# EAGLE design botboardpro-rev5 (EAGLE 4.14)
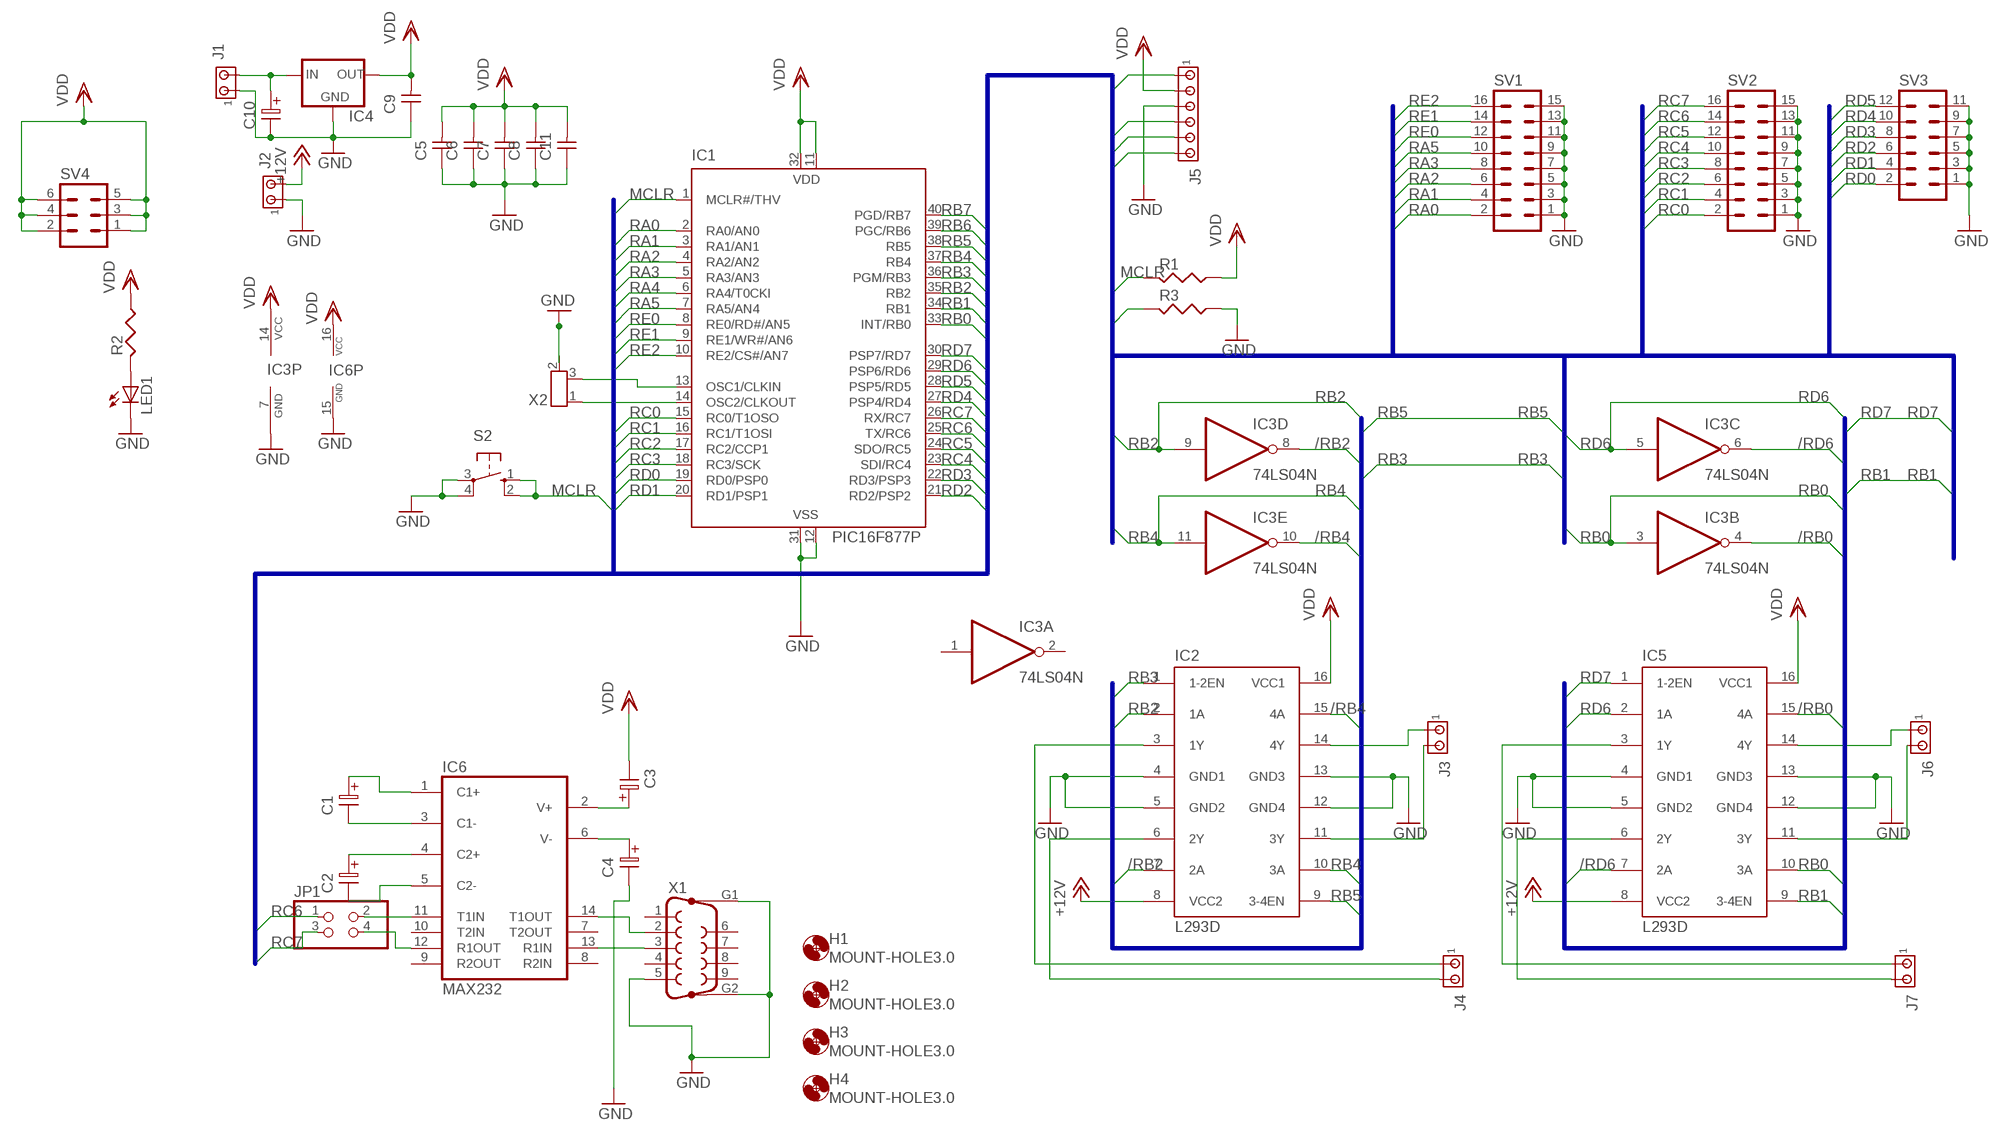
[diagram p0: schematic, sheet 1]

## Parts
C1  ELC-2,5L  [ES-2,5L]
C2  ELC-2,5L  [ES-2,5L]
C3  ELC-2,5L  [ES-2,5L]
C4  ELC-2,5L  [ES-2,5L]
C5  CAPNP-2,5  [C-2,5]
C6  CAPNP-2,5  [C-2,5]
C7  CAPNP-2,5  [C-2,5]
C8  CAPNP-2,5  [C-2,5]
C9  CAPNP-2,5  [C-2,5]
C10  ELC-2,5  [ES-2,5]
C11  CAPNP-2,5  [C-2,5]
H1  MOUNT-HOLE3.0  [3,0]
H2  MOUNT-HOLE3.0  [3,0]
H3  MOUNT-HOLE3.0  [3,0]
H4  MOUNT-HOLE3.0  [3,0]
IC1  PIC16F877P  [DIL40]
IC2  L293D  [DIL16]
IC3  74LS04N  [DIL14]
IC4  78XXS  [78XXS]
IC5  L293D  [DIL16]
IC6  MAX232  [DIL16]
J1  MTA02-100  [10X02MTA]
J2  MTA02-100  [10X02MTA]
J3  MTA02-100  [10X02MTA]
J4  MTA02-100  [10X02MTA]
J5  MTA06-100  [10X06MTA]
J6  MTA02-100  [10X02MTA]
J7  MTA02-100  [10X02MTA]
JP1  PINHD-2X2  [2X02]
LED1  LED5MM  [LED5MM]
R1  RESUS-S2,5  [RS-2,5]
R2  RESUS-S2,5  [RS-2,5]
R3  RESUS-S2,5  [RS-2,5]
S2  10-XX  [B3F-10XX]
SV1  MA08-2  [MA08-2]
SV2  MA08-2  [MA08-2]
SV3  MA06-2  [MA06-2]
SV4  MA03-2  [MA03-2]
X1  F09HP  [F09HP]
X2  RESONZTT  [RESONZTT]

## Nets
+12V: IC2.8(VCC2) IC5.8(VCC2) J2.2
/RB0: IC3.4(B:O) IC5.15(4A)
/RB2: IC2.7(2A) IC3.8(D:O)
/RB4: IC2.15(4A) IC3.10(E:O)
/RD6: IC3.6(C:O) IC5.7(2A)
GND: C4.2 C5.1 C6.1 C7.1 C8.1 C9.1 C10.2 C11.1 IC1.12(VSS) IC1.31(VSS) IC2.4(GND1) IC2.5(GND2) IC2.12(GND4) IC2.13(GND3) IC3.7(P:GND) IC4.GND IC5.4(GND1) IC5.5(GND2) IC5.12(GND4) IC5.13(GND3) IC6.15(GND) J1.1 J2.1 J5.4 LED1.K(C) R3.1 S2.3(P) S2.4(P1) SV1.1 SV1.3 SV1.5 SV1.7 SV1.9 SV1.11 SV1.13 SV1.15 SV2.1 SV2.3 SV2.5 SV2.7 SV2.9 SV2.11 SV2.13 SV2.15 SV3.1 SV3.3 SV3.5 SV3.7 SV3.9 SV3.11 X1.5 X1.G1 X1.G2
MCLR: IC1.1(MCLR#/THV) J5.6 R1.2 S2.1(S) S2.2(S1)
N$1: C10.1 IC4.IN J1.2
N$2: IC2.14(4Y) J3.1
N$3: IC2.11(3Y) J3.2
N$4: IC2.3(1Y) J4.1
N$5: IC2.6(2Y) J4.2
N$6: IC5.14(4Y) J6.1
N$7: IC5.11(3Y) J6.2
N$8: IC5.3(1Y) J7.1
N$9: IC5.6(2Y) J7.2
N$10: IC1.14(OSC2/CLKOUT) X2.1(X1)
N$11: C2.1 IC6.4(C2+)
N$12: C2.2 IC6.5(C2-)
N$13: C1.2 IC6.3(C1-)
N$14: C1.1 IC6.1(C1+)
N$15: C3.1 IC6.2(V+)
N$16: C4.1 IC6.6(V-)
N$17: IC1.13(OSC1/CLKIN) X2.3(X2)
N$18: IC6.14(T1OUT) X1.2
N$19: IC6.13(R1IN) X1.3
N$23: IC6.11(T1IN) JP1.2
N$24: LED1.A R2.2
N$25: IC6.12(R1OUT) JP1.4
RA0: IC1.2(RA0/AN0) SV1.2
RA1: IC1.3(RA1/AN1) SV1.4
RA2: IC1.4(RA2/AN2) SV1.6
RA3: IC1.5(RA3/AN3) SV1.8
RA4: IC1.6(RA4/T0CKI)
RA5: IC1.7(RA5/AN4) SV1.10
RB0: IC1.33(INT/RB0) IC3.3(B:I) IC5.10(3A)
RB1: IC1.34(RB1) IC5.9(3-4EN)
RB2: IC1.35(RB2) IC2.2(1A) IC3.9(D:I)
RB3: IC1.36(PGM/RB3) IC2.1(1-2EN) J5.1 R3.2
RB4: IC1.37(RB4) IC2.10(3A) IC3.11(E:I)
RB5: IC1.38(RB5) IC2.9(3-4EN)
RB6: IC1.39(PGC/RB6) J5.2
RB7: IC1.40(PGD/RB7) J5.3
RC0: IC1.15(RC0/T1OSO) SV2.2
RC1: IC1.16(RC1/T1OSI) SV2.4
RC2: IC1.17(RC2/CCP1) SV2.6
RC3: IC1.18(RC3/SCK) SV2.8
RC4: IC1.23(SDI/RC4) SV2.10
RC5: IC1.24(SDO/RC5) SV2.12
RC6: IC1.25(TX/RC6) JP1.1 SV2.14
RC7: IC1.26(RX/RC7) JP1.3 SV2.16
RD0: IC1.19(RD0/PSP0) SV3.2
RD1: IC1.20(RD1/PSP1) SV3.4
RD2: IC1.21(RD2/PSP2) SV3.6
RD3: IC1.22(RD3/PSP3) SV3.8
RD4: IC1.27(PSP4/RD4) SV3.10
RD5: IC1.28(PSP5/RD5) SV3.12
RD6: IC1.29(PSP6/RD6) IC3.5(C:I) IC5.2(1A)
RD7: IC1.30(PSP7/RD7) IC5.1(1-2EN)
RE0: IC1.8(RE0/RD#/AN5) SV1.12
RE1: IC1.9(RE1/WR#/AN6) SV1.14
RE2: IC1.10(RE2/CS#/AN7) SV1.16
VDD: C3.2 C5.2 C6.2 C7.2 C8.2 C9.2 C11.2 IC1.11(VDD) IC1.32(VDD) IC2.16(VCC1) IC3.14(P:VCC) IC4.OUT IC5.16(VCC1) IC6.16(VCC) J5.5 R1.1 R2.1 SV4.1 SV4.2 SV4.3 SV4.4 SV4.5 SV4.6
Unconnected: IC3.1(A:I) IC3.2(A:O) IC3.12(F:O) IC3.13(F:I) IC6.7(T2OUT) IC6.8(R2IN) IC6.9(R2OUT) IC6.10(T2IN) X1.1 X1.4 X1.6 X1.7 X1.8 X1.9

## Buses
RA[0..5],RB[0..7],RC[0..7],RD[0..7],RE[0..2],MCLR
RB5,RB4,/RB4,RB3,RB2,/RB2
RB1,RB0,/RB0,RD7,RD6,/RD6

## Power pins joined to a net without a drawn wire
GND: X2.2(GND)

## Library data of the parts
C1-C4 = discrete:ELC-2,5L
C5-C9 C11 = discrete:CAPNP-2,5
C10 = discrete:ELC-2,5
H1-H4 = holes:MOUNT-HOLE: MOUNTING HOLE with drill center marker
IC1 = microchip:PIC16F87*: MICROCONTROLLER
IC2 IC5 = st-microelectronics:L293D: PUSH-PULL 4 CHANNEL DRIVER
IC3 = 74xx-us:74*04: Hex INVERTER
IC4 = v-reg:78XXS: VOLTAGE REGULATOR
IC6 = maxim:MAX232: RS232 TRANSEIVER
J1-J4 J6 J7 = con-amp:MTA02-100: AMP connector
J5 = con-amp:MTA06-100: AMP connector
JP1 = pinhead:PINHD-2X2: PIN HEADER
LED1 = led:LED: LED OSRAM: - CHIPLED LG R971, LG N971, LY N971, LG Q971, LY Q971, LO R971, LY R971 LH N974, LH R974 LS Q976, LO Q976, LY Q976 LO Q996 - Hyper CHIPLED LW Q18S LB Q993, LB Q99A, LB R99A - SideLED LS A670, LO A670, LY A670, LG A670, LP A670 LB A673, LV A673, LT A673, LW A673 LH A674 LY A675 LS A676, LA A676, LO A676, LY A676, LW A676 LS A679, LY A679, LG A679 - Hyper Micro SIDELED® LS Y876, LA Y876, LO Y876, LY Y876 LT Y87S - SmartLED LW L88C, LW L88S LB L89C, LB L89S, LG L890 LS L89K, LO L89K, LY L89K LS L896, LA L896, LO L896, LY L896 - TOPLED LS T670, LO T670, LY T670, LG T670, LP T670 LSG T670, LSP T670, LSY T670, LOP T670, LYG T670 LG T671, LOG T671, LSG T671 LB T673, LV T673, LT T673, LW T673 LH T674 LS T676, LA T676, LO T676, LY T676, LB T676, LH T676, LSB T676, LW T676 LB T67C, LV T67C, LT T67C, LS T67K, LO T67K, LY T67K, LW E67C LS E67B, LA E67B, LO E67B, LY E67B, LB E67C, LV E67C, LT E67C LW T67C LS T679, LY T679, LG T679 LS T770, LO T770, LY T770, LG T770, LP T770 LB T773, LV T773, LT T773, LW T773 LH T774 LS E675, LA E675, LY E675, LS T675 LS T776, LA T776, LO T776, LY T776, LB T776 LHGB T686 LT T68C, LB T68C - Hyper Mini TOPLED® LB M676 - Mini TOPLED Santana® LG M470 LS M47K, LO M47K, LY M47K Source: http://www.osram.convergy.de/
R1-R3 = discrete:RESUS-S2,5
S2 = switch-omron:10-XX: OMRON SWITCH
SV1 SV2 = con-lstb:MA08-2: PIN HEADER
SV3 = con-lstb:MA06-2: PIN HEADER
SV4 = con-lstb:MA03-2: PIN HEADER
X1 = con-subd:F09HP: SUB-D
X2 = ADS:RESONZTT

## Board
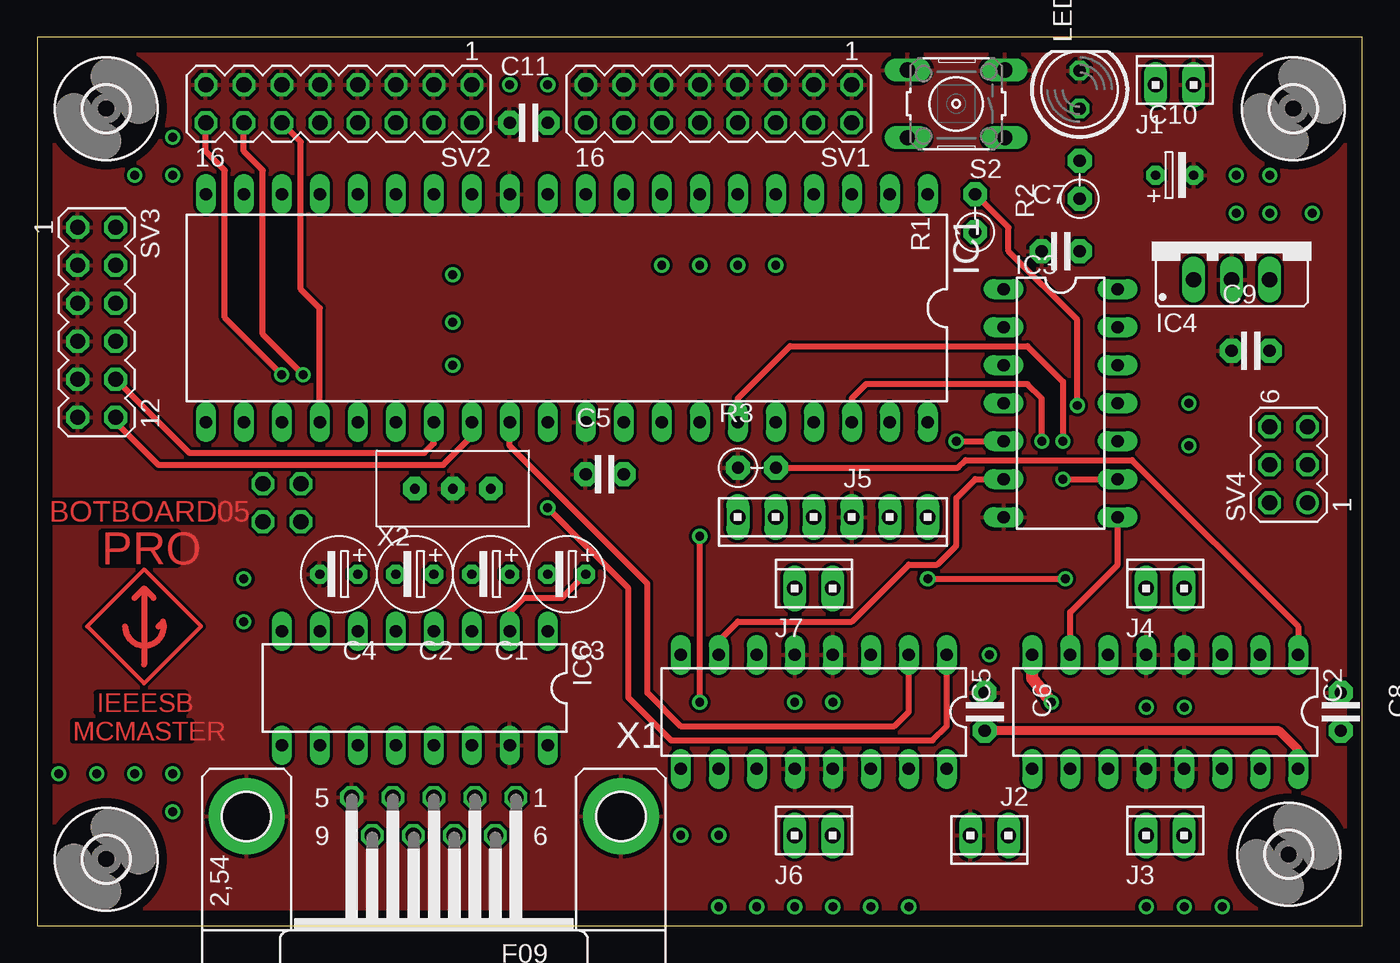
[diagram p1: board, top side]
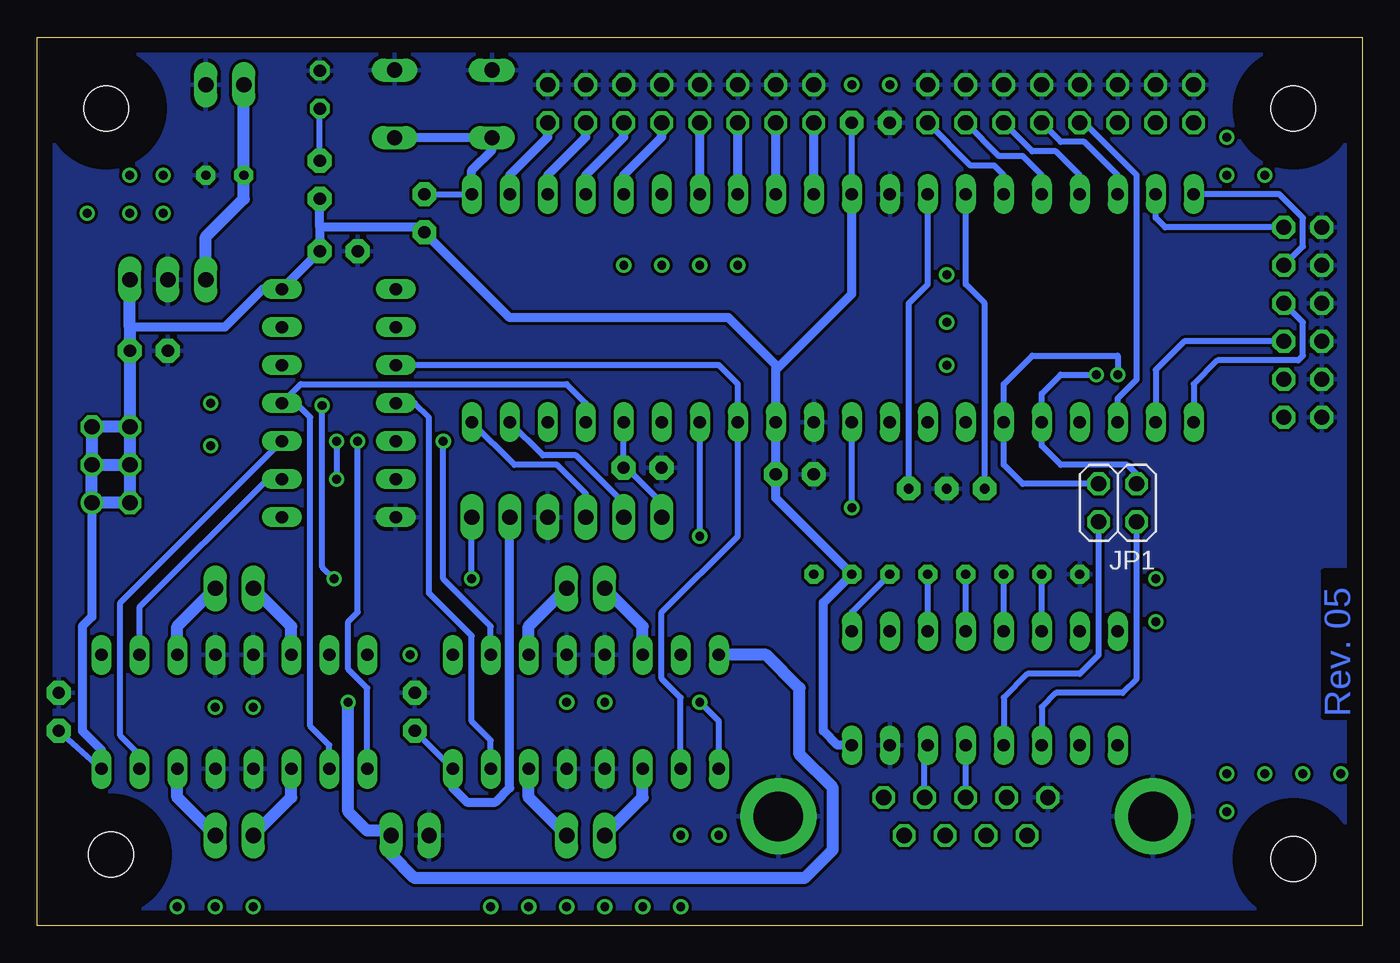
[diagram p2: board, bottom side, seen from below]

Size 88.57 x 59.36 mm. Coordinates in mm from the lower left corner, seen from the top.
Outline: 0,0 88.57,0 88.57,59.36 0,59.36 0,0
Copper layers (1*16): Top 0.035mm / dielectric 1.5mm / Bottom 0.035mm
Design rules "default": minimum track width 4mil, minimum drill 0.6mm, track to track 8mil, track to pad 8mil, pad to pad 8mil, via to via 8mil, smd to smd 8mil, copper to edge 40mil, drill to drill 8mil, minimum pad ring 10mil, minimum via ring 8mil, stop-mask expansion 4mil, vias tented up to drill 0mil, thermal gap 10mil

### Footprints (pad centres in the part's own frame; a part is rotated, then mirrored left to right if it is on the bottom)
ES-2,5L = drill 0.61 pad 1.27 octagon: 1 0,0; 2 2.54,0
C-2,5 = drill 0.813 pad 1.6 octagon: 1 -1.27,0; 2 1.27,0
ES-2,5 = drill 0.61 pad 1.27 octagon: 1 -1.27,0; 2 1.27,0
3,0 = hole 3: 0,0
DIL40 = drill 0.813 long: 1 -24.13,-7.62; 2 -21.59,-7.62; 3 -19.05,-7.62; 4 -16.51,-7.62; 5 -13.97,-7.62; 6 -11.43,-7.62; 7 -8.89,-7.62; 8 -6.35,-7.62; 9 -3.81,-7.62; 10 -1.27,-7.62; 11 1.27,-7.62; 12 3.81,-7.62; 13 6.35,-7.62; 14 8.89,-7.62; 15 11.43,-7.62; 16 13.97,-7.62; 17 16.51,-7.62; 18 19.05,-7.62; 19 21.59,-7.62; 20 24.13,-7.62; 21 24.13,7.62; 22 21.59,7.62; 23 19.05,7.62; 24 16.51,7.62; 25 13.97,7.62; 26 11.43,7.62; 27 8.89,7.62; 28 6.35,7.62; 29 3.81,7.62; 30 1.27,7.62; 31 -1.27,7.62; 32 -3.81,7.62; 33 -6.35,7.62; 34 -8.89,7.62; 35 -11.43,7.62; 36 -13.97,7.62; 37 -16.51,7.62; 38 -19.05,7.62; 39 -21.59,7.62; 40 -24.13,7.62
DIL16 = drill 0.813 long: 1 -8.89,-3.81; 2 -6.35,-3.81; 3 -3.81,-3.81; 4 -1.27,-3.81; 5 1.27,-3.81; 6 3.81,-3.81; 7 6.35,-3.81; 8 8.89,-3.81; 9 8.89,3.81; 10 6.35,3.81; 11 3.81,3.81; 12 1.27,3.81; 13 -1.27,3.81; 14 -3.81,3.81; 15 -6.35,3.81; 16 -8.89,3.81
DIL14 = drill 0.813 long: 1 -7.62,-3.81; 2 -5.08,-3.81; 3 -2.54,-3.81; 4 0,-3.81; 5 2.54,-3.81; 6 5.08,-3.81; 7 7.62,-3.81; 8 7.62,3.81; 9 5.08,3.81; 10 2.54,3.81; 11 0,3.81; 12 -2.54,3.81; 13 -5.08,3.81; 14 -7.62,3.81
78XXS = drill 1.016 long: GND 0,-2.54; IN -2.54,-2.54; OUT 2.54,-2.54
10X02MTA = drill 1.016 long: 1 1.27,0; 2 -1.27,0
10X06MTA = drill 1.016 long: 1 6.35,0; 2 3.81,0; 3 1.27,0; 4 -1.27,0; 5 -3.81,0; 6 -6.35,0
2X02 = drill 1.016 octagon: 1 -1.27,-1.27; 2 -1.27,1.27; 3 1.27,-1.27; 4 1.27,1.27
LED5MM = drill 0.813 octagon: A -1.27,0; K 1.27,0
RS-2,5 = drill 0.813 pad 1.6 octagon: 1 0,0; 2 2.54,0
B3F-10XX = drill 1.016 long: 1 -3.251,2.261; 2 3.251,2.261; 3 -3.251,-2.261; 4 3.251,-2.261
MA08-2 = drill 1.016 octagon: 1 -8.89,-1.27; 2 -8.89,1.27; 3 -6.35,-1.27; 4 -6.35,1.27; 5 -3.81,-1.27; 6 -3.81,1.27; 7 -1.27,-1.27; 8 -1.27,1.27; 9 1.27,-1.27; 10 1.27,1.27; 11 3.81,-1.27; 12 3.81,1.27; 13 6.35,-1.27; 14 6.35,1.27; 15 8.89,-1.27; 16 8.89,1.27
MA06-2 = drill 1.016 octagon: 1 -6.35,-1.27; 2 -6.35,1.27; 3 -3.81,-1.27; 4 -3.81,1.27; 5 -1.27,-1.27; 6 -1.27,1.27; 7 1.27,-1.27; 8 1.27,1.27; 9 3.81,-1.27; 10 3.81,1.27; 11 6.35,-1.27; 12 6.35,1.27
MA03-2 = drill 1.016 round: 1 -2.54,-1.27 | drill 1.016 octagon: 2 -2.54,1.27; 3 0,-1.27; 4 0,1.27; 5 2.54,-1.27; 6 2.54,1.27
F09HP = drill 1.016 octagon: 1 -5.486,-1.27; 2 -2.743,-1.27; 3 0,-1.27; 4 2.743,-1.27; 5 5.486,-1.27; 6 -4.115,1.27; 7 -1.372,1.27; 8 1.372,1.27; 9 4.115,1.27 | drill 3.302 pad 5.08 round: G1 -12.522,0; G2 12.522,0
RESONZTT = drill 0.66 pad 1.575 octagon: 1 0,0; 2 2.54,0; 3 5.08,0

### Placement (x,y rotation side)
C1  31.58,23.49 180 top
C2  26.5,23.49 180 top
C3  36.67,23.49 180 top
C4  21.43,23.49 180 top
C5  37.94,30.16 0 top
C6  63.34,14.28 270 top
C7  68.42,45.08 0 top
C8  87.15,14.28 270 top
C9  81.12,38.41 0 top
C10  76.03,50.16 0 top
C11  32.86,53.65 0 top
H1  4.6,4.44 0 top
H2  83.97,54.6 0 top
H3  83.66,4.76 0 top
H4  4.6,54.6 0 top
IC1  35.4,41.27 180 top
IC2  75.4,14.28 180 top
IC3  68.42,34.92 270 top
IC4  79.84,45.71 0 top
IC5  51.91,14.28 180 top
IC6  25.23,15.87 180 top
J1  76.03,56.19 0 top
J2  63.65,6.03 180 top
J3  75.4,6.03 0 top
J4  75.4,22.54 0 top
J5  53.18,27.3 180 top
J6  51.91,6.03 0 top
J7  51.91,22.54 0 top
JP1  16.34,28.25 180 bottom
LED1  69.69,55.88 90 top
R1  62.7,46.35 90 top
R2  69.69,48.57 90 top
R3  46.85,30.61 0 top
S2  61.43,54.92 180 top
SV1  45.55,54.92 180 top
SV2  20.15,54.92 180 top
SV3  3.96,40.32 270 top
SV4  83.66,30.79 90 top
X1  26.5,7.3 180 top
X2  25.23,29.2 0 top

### Tracks (layer width: path | path; a pad name or v marks a point on that pad's centre or on a via)
+12V  (via drill 0.6)
  Top 0.813: v67.78,14.92 66.51,16.5 IC2.8
  Bottom 0.813: IC5.8 39.84,18.09 37.62,15.87 37.62,11.42 35.4,9.2 35.4,5.08 37.3,3.17 63.34,3.17 64.92,4.76 64.92,6.35 | 64.92,6.35 J2.2 | 64.92,6.35 66.51,6.35 67.78,7.62 v67.78,14.92
/RB0
  Bottom 0.406: IC5.15 58.26,12.38 59.53,13.65 59.53,19.36 62.38,22.22 62.38,33.97 63.34,34.92 IC3.4
/RB2
  Top 0.406: IC2.7 69.05,20.95 72.23,24.12 IC3.8
/RB4
  Bottom 0.406: IC2.15 81.75,11.42 83.02,12.7 83.02,21.59 IC3.10
/RD6
  Top 0.406: IC5.7 45.55,19.04 46.83,20.31 54.45,20.31 58.26,24.12 60.16,24.12 61.43,25.39 61.43,28.57 62.7,29.84 IC3.6
GND
  pour Bottom: -2.07,61.27 -2.07,-1.59 90.32,-1.59 90.32,61.27
  pour Top: -1.44,60.95 90.01,60.95 90.01,-1.27 -1.44,-1.27
MCLR  (via drill 0.6)
  Top 0.406: R1.2 64.92,46.67 64.92,45.08 69.53,40.48 v69.53,34.76 | v59.53,23.17 v68.73,23.17
  Bottom 0.406: R1.2 62.7,48.57 62.38,48.89 IC1.1 | v59.53,23.17 J5.6 | v68.73,23.17 69.53,23.97 v69.53,34.76
  Bottom 0.61: IC1.1 59.53,50.48 58.18,51.82 S2.2 58.18,52.46 58.26,52.38 58.53,52.66 S2.1
N$1
  Bottom 0.813: J1.2 C10.1 74.77,48.57 77.31,46.03 IC4.IN
N$2
  Bottom 0.813: IC2.14 79.21,8.57 J3.1
N$3
  Bottom 0.813: IC2.11 71.59,8.57 J3.2
N$4
  Bottom 0.813: IC2.3 79.21,20 J4.1
N$5
  Bottom 0.813: IC2.6 71.59,20 J4.2
N$6
  Bottom 0.813: IC5.14 55.72,8.57 J6.1
N$7
  Bottom 0.813: IC5.11 48.1,8.57 J6.2
N$8
  Bottom 0.813: IC5.3 55.72,20 J7.1
N$9
  Bottom 0.813: IC5.6 48.1,20 J7.2
N$10
  Bottom 0.406: X2.1 25.23,41.59 26.5,42.86 IC1.14
N$11
  Bottom 0.406: IC6.4 C2.1
N$12
  Bottom 0.406: IC6.5 C2.2
N$13
  Bottom 0.406: IC6.3 C1.2
N$14
  Bottom 0.406: IC6.1 34.12,20.95 C1.1
N$15
  Top 0.406: IC6.2 31.58,20.95 32.54,21.9 35.08,21.9 C3.1
N$16
  Bottom 0.406: IC6.6 C4.1
N$17
  Bottom 0.406: X2.3 30.31,41.59 29.04,42.86 IC1.13
N$18
  Bottom 0.406: X1.2 29.25,11.86 IC6.14
N$19
  Bottom 0.406: X1.3 IC6.13
N$20
  Top 0.254: 7.14,23.81 10.95,20 7.14,16.19 3.33,20 7.14,23.81
N$21
  Top 0.406: 7.14,22.54 7.14,17.46 | 6.5,21.9 7.14,22.54 | 7.14,22.54 7.77,21.9
N$22
  Top 0.406: 5.87,20 arc194 8.41,20.31 8.09,20
N$23
  Bottom 0.406: IC6.11 21.43,14.6 20.47,15.55 16.03,15.55 15.07,16.5 JP1.2
N$24
  Bottom 0.406: R2.2 LED1.A
N$25
  Bottom 0.406: JP1.4 17.61,18.09 18.88,16.82 22.38,16.82 23.96,15.23 IC6.12
N$26  (via drill 0.6)
  other vias: 1.42,10.15
N$27  (via drill 0.6)
  other vias: 3.96,10.15
N$28  (via drill 0.6)
  other vias: 6.5,10.15
N$29  (via drill 0.6)
  other vias: 9.04,10.15
N$30  (via drill 0.6)
  other vias: 9.04,7.62
N$31  (via drill 0.6)
  other vias: 9.04,50.16
N$32  (via drill 0.6)
  other vias: 9.04,52.7
N$33  (via drill 0.6)
  other vias: 6.5,50.16
N$34  (via drill 0.6)
  other vias: 31.58,56.19
N$35  (via drill 0.6)
  other vias: 34.12,56.19
N$36  (via drill 0.6)
  other vias: 80.16,50.16
N$37  (via drill 0.6)
  other vias: 82.39,50.16
N$38  (via drill 0.6)
  other vias: 80.16,47.62
N$39  (via drill 0.6)
  other vias: 82.39,47.62
N$40  (via drill 0.6)
  other vias: 85.24,47.62
N$41  (via drill 0.6)
  other vias: 41.75,44.13
N$42  (via drill 0.6)
  other vias: 44.29,44.13
N$43  (via drill 0.6)
  other vias: 46.83,44.13
N$44  (via drill 0.6)
  other vias: 49.37,44.13
N$45  (via drill 0.6)
  other vias: 76.99,34.92
N$46  (via drill 0.6)
  other vias: 76.99,32.06
N$47  (via drill 0.6)
  other vias: 13.8,23.17
N$48  (via drill 0.6)
  other vias: 13.8,20.31
N$49  (via drill 0.6)
  other vias: 50.64,14.92
N$50  (via drill 0.6)
  other vias: 53.18,14.92
N$51  (via drill 0.6)
  other vias: 74.13,14.6
N$52  (via drill 0.6)
  other vias: 76.67,14.6
N$53  (via drill 0.6)
  other vias: 43.02,6.03
N$54  (via drill 0.6)
  other vias: 45.55,6.03
N$55  (via drill 0.6)
  other vias: 45.55,1.27
N$56  (via drill 0.6)
  other vias: 48.1,1.27
N$57  (via drill 0.6)
  other vias: 50.64,1.27
N$58  (via drill 0.6)
  other vias: 53.18,1.27
N$59  (via drill 0.6)
  other vias: 55.72,1.27
N$60  (via drill 0.6)
  other vias: 58.26,1.27
N$61  (via drill 0.6)
  other vias: 27.77,37.46
N$62  (via drill 0.6)
  other vias: 27.77,40.32
N$63  (via drill 0.6)
  other vias: 27.77,43.49
N$64  (via drill 0.6)
  other vias: 79.21,1.27
N$65  (via drill 0.6)
  other vias: 76.67,1.27
N$66  (via drill 0.6)
  other vias: 74.13,1.27
N$67  (via drill 0.6)
  other vias: 63.65,18.09
RA0
  Bottom 0.61: SV1.2 54.45,52.7 56.98,50.16 IC1.2
RA1
  Bottom 0.61: SV1.4 51.91,52.7 54.45,50.16 IC1.3
RA2
  Bottom 0.61: SV1.6 49.37,52.7 51.91,50.16 IC1.4
RA3
  Bottom 0.61: SV1.8 46.83,52.7 49.37,50.16 IC1.5
RA5
  Bottom 0.61: IC1.7 SV1.10
RB0
  Bottom 0.406: IC5.10 45.55,15.23 46.83,16.5 46.83,20.95 41.75,26.03 IC1.33 41.75,36.19 43.02,37.46 IC3.3
RB1  (via drill 0.6)
  Top 0.406: v44.29,14.92 v44.29,26.03
  Bottom 0.406: IC5.9 43.02,13.65 v44.29,14.92 | v44.29,26.03 IC1.34
RB2  (via drill 0.6)
  Top 0.406: v68.57,29.84 IC3.9 | v68.57,32.38 68.57,36.35 66.19,38.73 50.32,38.73 46.83,35.24 IC1.35
  Bottom 0.406: IC3.9 73.18,29.84 81.75,21.27 IC2.2 | v68.57,32.38 v68.57,29.84
RB3
  Top 0.406: R3.2 61.56,30.61 62.07,31.11 73.18,31.11 84.29,20 IC2.1 84.29,17.77
  Bottom 0.406: J5.1 46.83,28.25 49.37,30.79 49.39,30.77 R3.2 49.39,33.62 IC1.36
RB4
  Bottom 0.406: IC1.37 51.91,34.92 53.18,36.19 70.95,36.19 IC3.11 71.27,34.92 70.32,33.97 70.32,13.33 69.05,12.06 IC2.10 69.05,10.15
RB5  (via drill 0.6)
  Top 0.406: IC1.38 54.45,35.24 55.4,36.19 66.19,36.19 67.14,35.24 v67.14,32.38
  Bottom 0.406: v67.14,32.38 67.14,20.95 67.78,20.31 67.78,17.14 66.51,15.87 IC2.9
RB6
  Bottom 0.406: J5.2 49.37,28.25 52.54,31.43 54.76,31.43 IC1.39
RB7
  Bottom 0.406: J5.3 51.91,28.89 53.81,30.79 56.67,30.79 IC1.40
RC0
  Bottom 0.406: IC1.15 23.96,50.16 24.6,50.8 26.19,50.8 SV2.2
RC1
  Bottom 0.406: IC1.16 21.43,50.16 22.7,51.43 24.28,51.43 SV2.4
RC2
  Bottom 0.406: IC1.17 18.88,50.16 20.47,51.75 22.06,51.75 SV2.6
RC3
  Bottom 0.406: IC1.18 16.34,50.16 18.57,52.38 20.15,52.38 SV2.8
RC4
  Bottom 0.406: IC1.23 16.34,35.24 15.07,36.51 15.07,50.16 18.25,53.34 SV2.10
RC5
  Top 0.406: IC1.24 18.88,41.27 17.61,42.54 17.61,52.38 SV2.12
RC6  (via drill 0.6)
  Top 0.406: SV2.14 13.8,51.75 15.07,50.48 15.07,39.52 v17.77,36.83
  Bottom 0.406: v17.77,36.83 20.15,36.83 21.43,35.55 IC1.25 21.43,32.06 20.15,30.79 15.71,30.79 15.07,30.16 JP1.1
RC7  (via drill 0.6)
  Top 0.406: SV2.16 11.26,51.75 12.54,50.48 12.54,40.63 v16.34,36.83
  Bottom 0.406: v16.34,36.83 16.34,38.09 22.06,38.09 23.96,36.19 IC1.26 23.96,30.79 22.7,29.52 JP1.3
RD0
  Bottom 0.406: IC1.19 13.8,47.3 13.17,46.67 5.55,46.67 5.23,46.35 SV3.2
RD1
  Bottom 0.406: IC1.20 5.55,48.89 3.96,47.3 3.96,45.4 SV3.4
RD2
  Bottom 0.406: IC1.21 11.26,36.19 9.68,37.78 4.28,37.78 3.96,38.09 3.96,40.32 SV3.6
RD3
  Bottom 0.406: IC1.22 13.8,37.14 11.9,39.05 SV3.8
RD4
  Top 0.406: IC1.27 26.5,32.22 25.87,31.59 10.15,31.59 SV3.10
RD5
  Top 0.406: SV3.12 5.23,33.65 8.09,30.79 27.14,30.79 29.04,32.7 IC1.28
RD6  (via drill 0.6)
  Top 0.406: IC5.2 58.26,14.28 57.3,13.33 43.02,13.33 40.79,15.55 40.79,22.86 31.58,32.06 IC1.29 | v61.43,32.38 IC3.5
  Bottom 0.406: IC5.2 58.26,20 61.43,23.17 v61.43,32.38
RD7  (via drill 0.6)
  Top 0.406: IC5.1 60.8,13.33 59.84,12.38 42.38,12.38 39.52,15.23 39.52,22.54 v34.12,27.93
  Bottom 0.406: v34.12,27.93 IC1.30
RE0
  Bottom 0.61: IC1.8 SV1.12
RE1
  Bottom 0.61: IC1.9 SV1.14
RE2
  Bottom 0.61: IC1.10 SV1.16
VDD
  Top 0.61: IC2.16 84.29,11.74 83.02,13.01 C6.2
  Bottom 0.406: C6.2 IC5.16 | IC2.16 C8.2 | 39.21,33.97 IC1.32 C5.2 | IC1.11 C11.2
  Bottom 0.61: IC1.11 34.12,42.22 39.21,37.14 IC1.32 | J5.5 56.98,9.2 57.94,8.25 59.84,8.25 60.8,9.2 IC5.16 | 39.21,28.57 C5.2 | 39.21,28.57 C3.2 36.03,21.59 36.03,13.01 35.08,12.06 IC6.16 | 69.69,46.67 C7.2 IC3.14 73.5,42.54 76.03,40 82.39,40 | 69.69,46.67 R2.1 | SV4.1 84.92,20.63 85.56,20 85.56,13.01 84.29,11.74 IC2.16 | 39.21,28.57 39.21,37.46 42.38,40.63 56.98,40.63 R1.1 63.02,46.67 69.69,46.67
  Bottom 0.813: IC4.OUT 82.39,40 82.39,38.73 82.7,38.41 C9.2 82.39,33.65 | SV4.6 82.07,33.33 82.39,33.65 | SV4.6 SV4.5 SV4.3 | SV4.3 SV4.4 | 82.39,33.65 SV4.6 | 82.39,33.65 SV4.2 SV4.1 SV4.3

### Text on the board
Top: BOTBOARD05 | PRO | IEEESB | MCMASTER
Bottom: Rev. 05